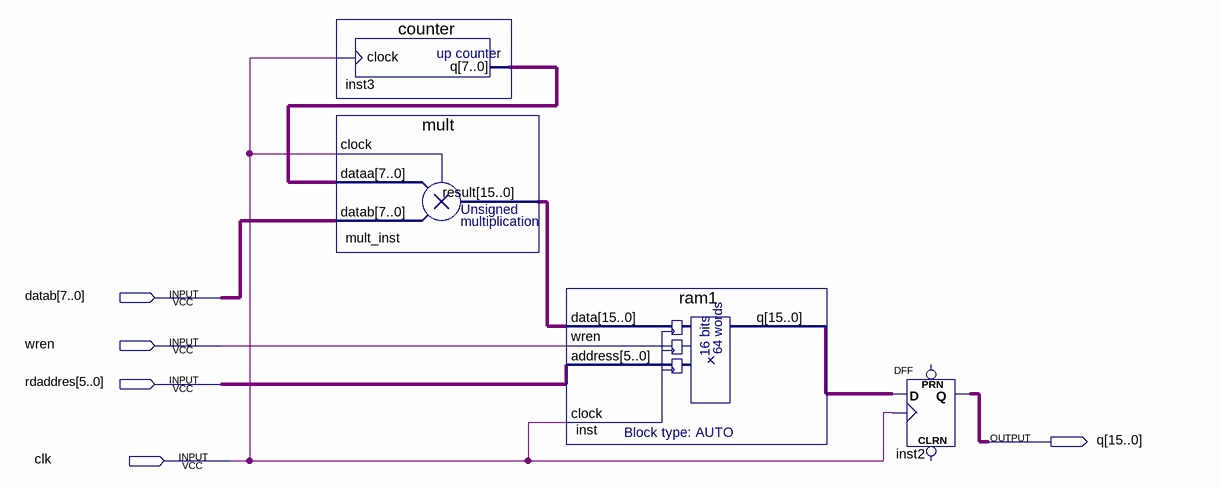
[diagram p0: schematic sheet]
// Quartus schematic dop.bdf as structural Verilog: 4 symbols, 5 pins
module dop (
  input  [7:0] datab,
  input  wren,
  input  [5:0] rdaddres,
  input  clk,
  output [15:0] q
);

  wire [7:0] inst3_q;
  wire [15:0] inst_q, mult_inst_result;

  counter inst3 (.clock(clk), .q(inst3_q));
  mult mult_inst (.clock(clk), .dataa(inst3_q), .datab(datab), .result(mult_inst_result));
  ram1 inst (.data(mult_inst_result), .wren(wren), .address(rdaddres), .clock(clk), .q(inst_q));
  DFF inst2[15:0] (.CLK(clk), .D(inst_q), .Q(q));  // open: CLRN, PRN
endmodule
